# Altium project Hw_AIoT_Warehouse_Monitoring.PrjPcb
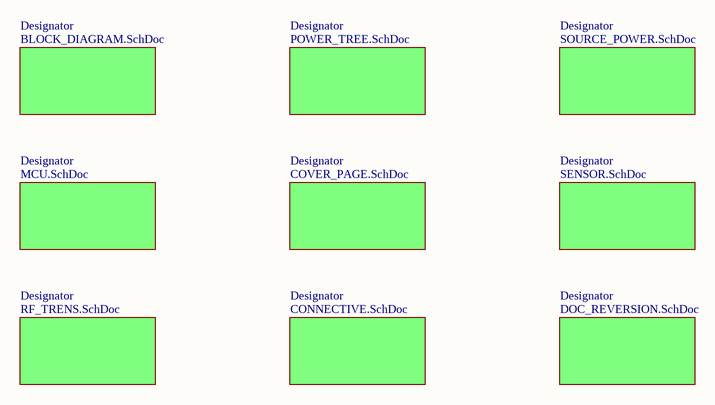
[diagram p0: LINK_PAGE.SchDoc]
10 sheets, 99 parts. Net scope: flat (ports and power ports of the same name join across sheets).
Sheets:
  LINK_PAGE.SchDoc
    Designator = BLOCK_DIAGRAM.SchDoc
    Designator = POWER_TREE.SchDoc
    Designator = SOURCE_POWER.SchDoc
    Designator = MCU.SchDoc
    Designator = COVER_PAGE.SchDoc
    Designator = SENSOR.SchDoc
    Designator = RF_TRENS.SchDoc
    Designator = CONNECTIVE.SchDoc
    Designator = DOC_REVERSION.SchDoc

## Sheet LINK_PAGE.SchDoc
size A; SheetNumber: 1; SheetTotal: 10

### Sub-sheets
Designator = BLOCK_DIAGRAM.SchDoc: no entries
Designator = POWER_TREE.SchDoc: no entries
Designator = SOURCE_POWER.SchDoc: no entries
Designator = MCU.SchDoc: no entries
Designator = COVER_PAGE.SchDoc: no entries
Designator = SENSOR.SchDoc: no entries
Designator = RF_TRENS.SchDoc: no entries
Designator = CONNECTIVE.SchDoc: no entries
Designator = DOC_REVERSION.SchDoc: no entries

## Sheet BLOCK_DIAGRAM.SchDoc
size A3; SheetNumber: 3; SheetTotal: 10
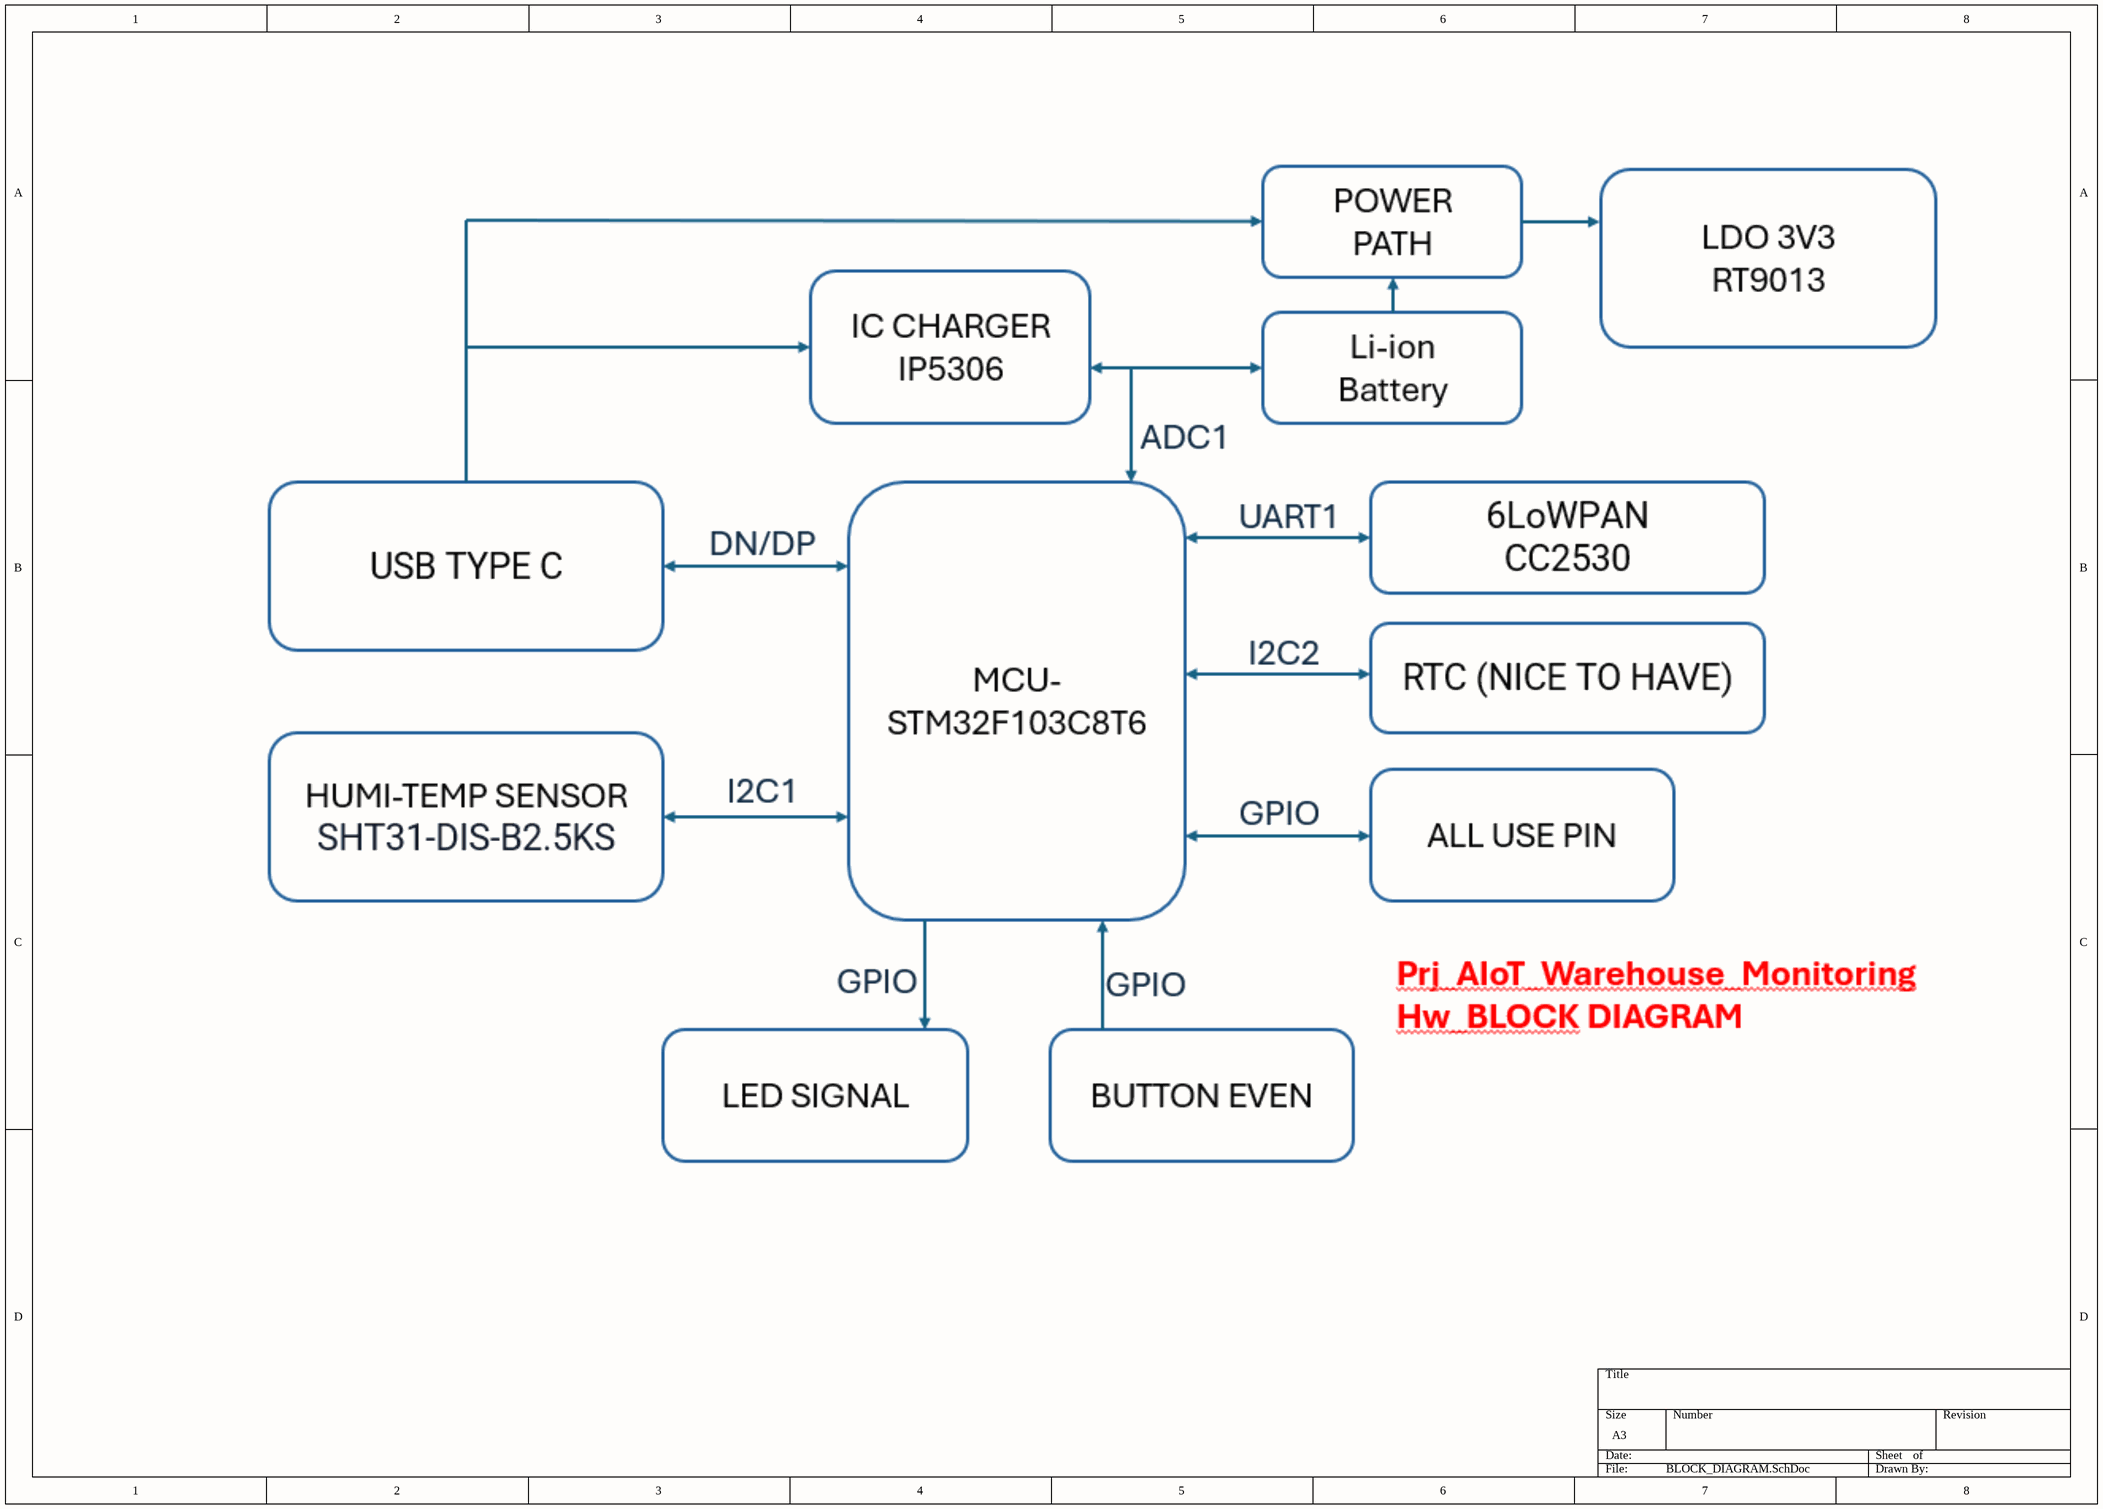
[diagram p1: BLOCK_DIAGRAM.SchDoc]

## Sheet POWER_TREE.SchDoc
size A; SheetNumber: 4; SheetTotal: 10

## Sheet SOURCE_POWER.SchDoc
size A3; SheetNumber: 5; SheetTotal: 10
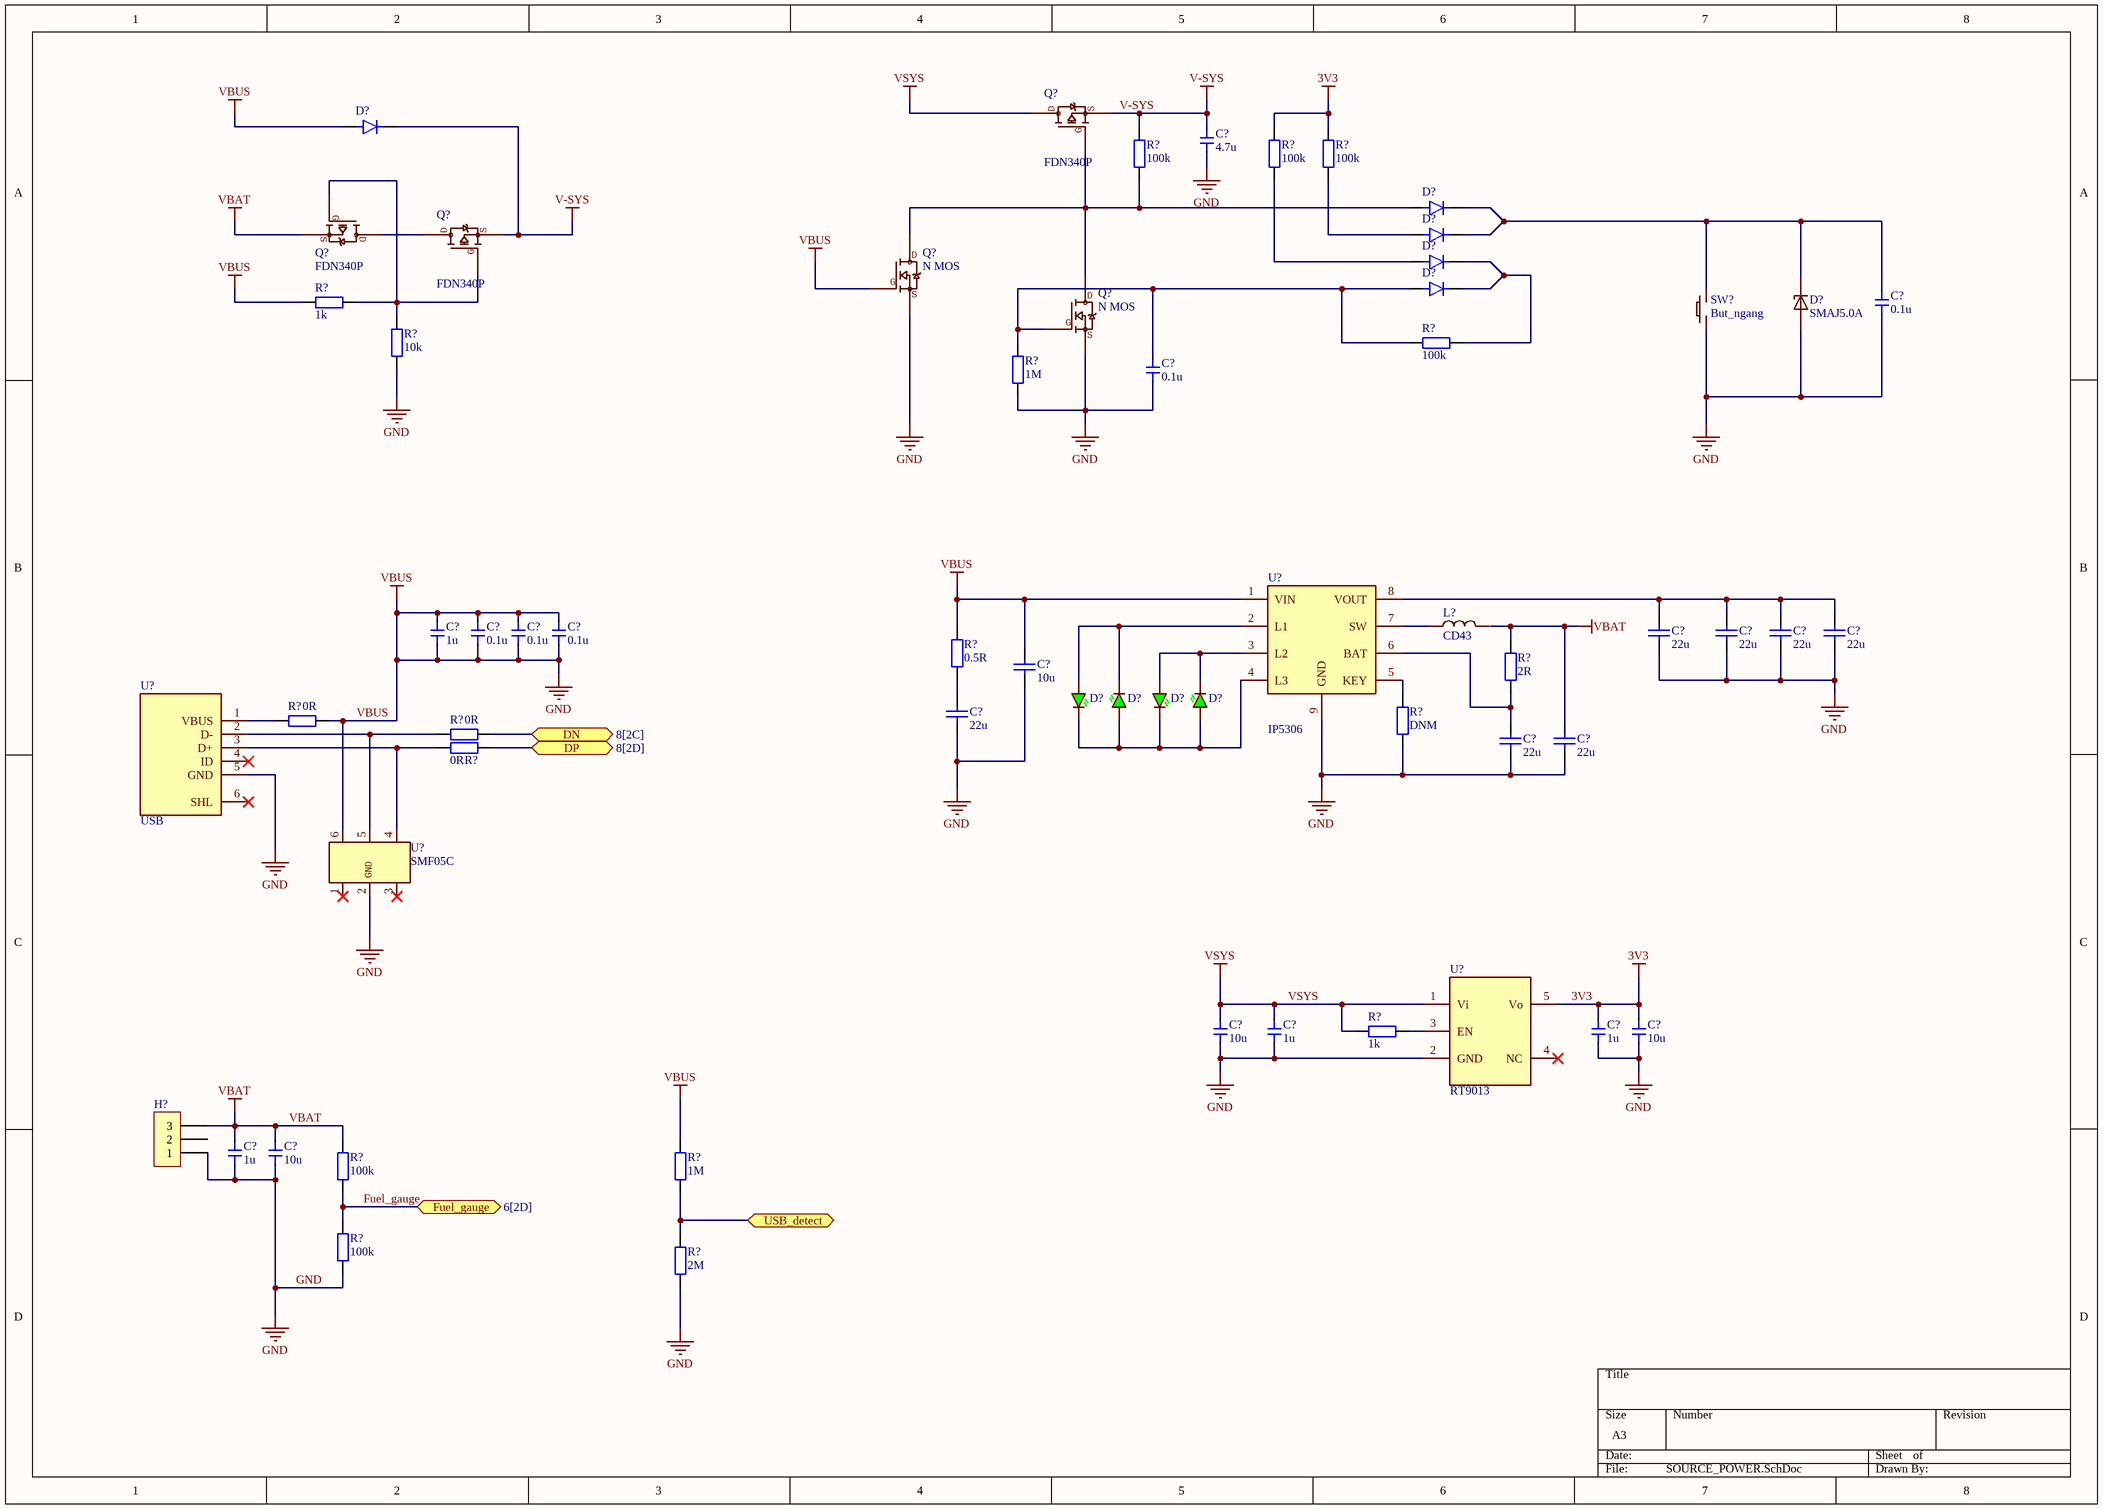
[diagram p2: SOURCE_POWER.SchDoc]

### Parts
(Parts that share a designator on the sheet are numbered #1, #2 ... from top to bottom, then left to right.)
C?#1  4.7u  [Cap 0603]
C?#2  0.1u  [Cap 0603]
C?#3  0.1u  [Cap 0603]
C?#4  22u  [tu 0805]
C?#5  22u  [tu 0805]
C?#6  22u  [tu 0805]
C?#7  22u  [tu 0805]
C?#8  1u  [Cap 0603]
C?#9  0.1u  [Cap 0603]
C?#10  0.1u  [Cap 0603]
C?#11  0.1u  [Cap 0603]
C?#12  10u  [tu 0805]
C?#13  22u  [tu 0805]
C?#14  22u  [tu 0805]
C?#15  22u  [tu 0805]
C?#16  10u  [Cap 0603]
C?#17  1u  [Cap 0603]
C?#18  1u  [Cap 0603]
C?#19  10u  [Cap 0603]
C?#20  1u  [Cap 0603]
C?#21  10u  [Cap 0603]
D?#1  LL4148  [DIO_LL4148]  (value not drawn)
D?#2  LL4148  [DIO_LL4148]  (value not drawn)
D?#3  LL4148  [DIO_LL4148]  (value not drawn)
D?#4  LL4148  [DIO_LL4148]  (value not drawn)
D?#5  LL4148  [DIO_LL4148]  (value not drawn)
D?#6  SMAJ5.0A  [DIOM4325X250N]
D?#7  Led 0603  [LED 0603]  (value not drawn)
D?#8  Led 0603  [LED 0603]  (value not drawn)
D?#9  Led 0603  [LED 0603]  (value not drawn)
D?#10  Led 0603  [LED 0603]  (value not drawn)
H?  Header 3P 2.54 Duc Thang  [XH2.54M-3]  (value not drawn)
L?  CD43  [CD43]
Q?#1  FDN340P  [FDN340P]
Q?#2  FDN340P  [FDN340P]
Q?#3  FDN340P  [FDN340P]
Q?#4  N MOS  [FDN340P]
Q?#5  N MOS  [FDN340P]
R?#1  100k  [Tro smd 0603]
R?#2  100k  [Tro smd 0603]
R?#3  100k  [Tro smd 0603]
R?#4  1k  [tro smd 0603]
R?#5  10k  [tro smd 0603]
R?#6  100k  [Tro smd 0603]
R?#7  1M  [Tro smd 0603]
R?#8  0.5R  [tro smd 0603]
R?#9  2R  [tro smd 0603]
R?#10  0R  [tro smd 0603]
R?#11  DNM  [tro smd 0603]
R?#12  0R  [tro smd 0603]
R?#13  0R  [tro smd 0603]
R?#14  1k  [tro smd 0603]
R?#15  100k  [Tro smd 0603]
R?#16  1M  [Tro smd 0603]
R?#17  100k  [Tro smd 0603]
R?#18  2M  [Tro smd 0603]
SW?#1  But_ngang  [But_ngang]
U?#1  IP5306  [IP5306]
U?#2  USB  [USB]
U?#3  SMF05C  [SOT-363]
U?#4  RT9013  [RT9013]

### Ports
DN (bidir, see 8[2C]), DP (bidir, see 8[2D]), Fuel_gauge (bidir, see 6[2D]), USB_detect (bidir)

### Nets
3V3: C?#18.1 C?#19.1 R?#2.2 R?#3.2 U?#4.5(Vo)
GND: C?#1.2 C?#2.2 C?#3.2 C?#4.2 C?#5.2 C?#6.2 C?#7.2 C?#8.1 C?#8.2 C?#9.1 C?#9.2 C?#10.1 C?#10.2 C?#11.1 C?#11.2 C?#12.1 C?#12.2 C?#13.2 C?#14.2 C?#15.2 C?#16.2 C?#17.2 C?#18.2 C?#19.2 C?#20.2 C?#21.2 D?#1.A D?#6.A H?.1 Q?#4.1(G) Q?#4.2(S) Q?#5.2(S) R?#4.1 R?#5.1 R?#7.1 R?#8.2 R?#10.2 R?#11.1 R?#16.2 R?#17.1 R?#18.1 SW?#1.1 U?#1.1(VIN) U?#1.9(GND) U?#2.5(GND) U?#3.2(GND) U?#3.6(IN4) U?#4.2(GND)  [also labelled VBUS]
V-SYS: C?#1.1 D?#1.C Q?#1.2(S) Q?#3.2(S) R?#1.2
VBAT: C?#15.1 C?#20.1 C?#21.1 H?.3 Q?#2.2(S) R?#9.2 R?#15.2
VSYS: C?#16.1 C?#17.1 Q?#1.3(D) R?#14.2 U?#4.1(Vi)
Fuel_gauge: R?#15.1 R?#17.2 ; port Fuel_gauge
NetC?#2_1: C?#2.1 D?#2.C D?#3.C D?#6.C SW?#1.2
NetC?#3_1: C?#3.1 D?#5.A Q?#5.1(G) R?#6.2 R?#7.2
NetC?#4_1: C?#4.1 C?#5.1 C?#6.1 C?#7.1 U?#1.8(VOUT)
NetC?#13_1: C?#13.1 R?#8.1
NetC?#14_1: C?#14.1 R?#9.1 U?#1.6(BAT)
NetD?#2_A: D?#2.A Q?#1.1(G) Q?#4.3(D) Q?#5.3(D) R?#1.1
NetD?#3_A: D?#3.A R?#3.1
NetD?#4_A: D?#4.A R?#2.1
NetD?#4_C: D?#4.C D?#5.C R?#6.1
NetD?#7_1: D?#7.1 D?#8.2 U?#1.2(L1)
NetD?#7_2: D?#7.2 D?#8.1 D?#9.2 D?#10.1 U?#1.4(L3)
NetD?#9_1: D?#9.1 D?#10.2 U?#1.3(L2)
NetJ?#2_2: R?#12.2 ; port DN
NetJ?#3_2: R?#13.2 ; port DP
NetL?_1: L?.1 U?#1.7(SW)
NetQ?#2_1: Q?#2.1(G) Q?#3.1(G) R?#4.2 R?#5.2
NetQ?#2_3: Q?#2.3(D) Q?#3.3(D)
NetR?#10_1: R?#10.1 U?#2.1(VBUS)
NetR?#11_2: R?#11.2 U?#1.5(KEY)
NetR?#12_1: R?#12.1 U?#2.2(D-) U?#3.5(IN4)
NetR?#13_1: R?#13.1 U?#2.3(D+) U?#3.4(IN3)
NetR?#14_1: R?#14.1 U?#4.3(EN)
NetR?#16_1: R?#16.1 R?#18.2 ; port USB_detect

Not connected (* = marked no-connect by the designer): H? 2; L? 2(10); U?#2 4(ID)* 6(SHL)*; U?#3 1(IN1)* 3(IN2)*; U?#4 4(NC)*

### Library data of the parts
C?#1-C?#3 C?#8-C?#11 C?#16-C?#21 = Cap 0603: Capacitor SMD 0603
C?#4-C?#7 C?#12-C?#15 = Tu 0805 20pF 50V 10%: Dán; Don_Vi: Con; Ten_Linh_Kien: Tụ 0805 20P 10% 50V; So_Chan: 2; Ma_Hang: MH004558; Chung_Loai: Dán; Kieu_Chan: *
D?#1-D?#5 = LL4148: Diode Standard 100 V 300mA Surface Mount SOD-80 MiniMELF; MF: onsemi; SnapEDA_Link: https://www.snapeda.com/parts/LL4148/Onsemi/view-part/?ref=snap; Package: SOD-80-2 ON Semiconductor; Value: *; MP: LL4148; Check_prices: https://www.snapeda.com/parts/LL4148/Onsemi/view-part/?ref=eda
D?#6 = SMAJ5.0A: 13.4V Clamp 174A (8/20Âµs) Ipp Tvs Diode Surface Mount SMA (DO-214AC); MP: SMAJ5.0A-TR; MF: STMicroelectronics; Purchase-URL: https://pricing.snapeda.com/search/part/SMAJ5.0A-TR/?ref=eda; Check_prices: https://www.snapeda.com/parts/SMAJ5.0A-TR/STMicroelectronics/view-part/?ref=eda; Availability: In Stock; Value: *; Price: None; Package: DO-214 STMicroelectronics; SnapEDA_Link: https://www.snapeda.com/parts/SMAJ5.0A-TR/STMicroelectronics/view-part/?ref=snap
H? = Header 3P 2.54 Duc Thang: Cắm; Ten_Linh_Kien: Header 3P XH2.54-3P Đực Thẳng; Don_Vi: Con; Ma_Hang: MH001292; Chung_Loai: Cắm
L? = CD43: https://www.thegioiic.com/cuon-cam-dan-smd-cd43-4532-1r0-1uh-2-7a
Q?#1-Q?#3 = FDN340P: Small Signal Field-Effect Transistor, 2A I(D), 20V, 1-Element, P-Channel, Silicon, Metal-oxide Semiconductor FET; Manufacturer: ON Semiconductor / Fairchild; Package Body Material: Plastic; Number of Elements: 1; Drain-source On Resistance-Max: 70R; Operating Mode: ENHANCEMENT MODE; Power Dissipation-Max (Abs): 500mW; Transistor Application: SWITCHING; Qualification Status: Not Qualified; Supplier 1: Digikey; Supplier Part Number 1: FDN340PCT-ND; Supplier: Digikey; Supplier Part Number: FDN340PCT-ND; Manufacturer Part Number: FDN340P; RoHS: Yes; Category: MOSFETs; Stock: 82276; Pricing: 1=0.46, 10=0.355, 100=0.213, 500=0.1972, 1000=0.1341, 3000=0.12345, 6000=0.11832, 9000=0.10649, 30000=0.10491, 75000=0.0986 (USD); Pins: 3; Package Shape: Rectangular; Transistor Element Material: SILICON; Terminal Finish: Tin; Max Operating Temperature: 150°C; JESD-30 Code: R-PDSO-G3; Moisture Sensitivity Level: 1; Package Style: SMALL OUTLINEMeter; Surface Mount: Yes; Terminal Form: Gull Wing; Terminal Position: DUAL; Polarity/Channel Type: P-CHANNEL; Drain Current-Max (Abs) (ID): 2A; Drain Current-Max (ID): 2A; DS Breakdown Voltage-Min: 20V; FET Technology: METAL-OXIDE SEMICONDUCTOR; JESD-609 Code: e3; Reach SVHC Compliant: Yes; RoHS Compliant: Yes; ComponentLink1URL: https://datasheet.ciiva.com:443/pdfs/VipMasterIC/IC/ONSM/ONSM-S-A0003584711/ONSM-S-A0003584686-1.pdf?src-supplier=IHS+Markit; ComponentLink1Description: https://datasheet.ciiva.com:443/pdfs/VipMasterIC/IC/ONSM/ONSM-S-A0003584711/ONSM-S-A0003584686-1.pdf?src-supplier=IHS+Markit
Q?#4 Q?#5 = LN2302LT1G: https://www.thegioiic.com/ln2302lt1g-mosfet-kenh-n-20v-2-3a-sot-23-3
R?#1-R?#3 R?#6 R?#7 R?#15-R?#18 = Tro 0603 1% 33k: Dán; Don_Vi: Con; So_Chan: 2; Ten_Linh_Kien: Trở 0603 1% 33k; Ma_Hang: MH006335; Chung_Loai: Dán; Kieu_Chan: *
R?#4 = Tro 0603 1% 1k: Dán; So_Chan: 2; Don_Vi: Con; Ten_Linh_Kien: Trở 0603 1% 1k; Ma_Hang: MH006334; Chung_Loai: Dán; Kieu_Chan: *
R?#5 = Tro 0603 1% 10k: Dán; Don_Vi: Con; So_Chan: 2; Ten_Linh_Kien: Trở 0603 1% 10k; Ma_Hang: MH006333; Chung_Loai: Dán; Kieu_Chan: *
R?#8 R?#9 R?#11 R?#14 = Tro 0603 1% 1R: Dán; Don_Vi: Con; So_Chan: 2; Ten_Linh_Kien: Trở 0603 1% 1R; Ma_Hang: MH007007; Chung_Loai: Dán; Kieu_Chan: *
R?#10 R?#12 R?#13 = Tro 0603 1% 0R: Dán; Don_Vi: Con; So_Chan: 2; Ten_Linh_Kien: Trở 0603 1% 0R; Ma_Hang: MH005792; Chung_Loai: Dán; Kieu_Chan: *
SW?#1 = But_ngang: https://www.thegioiic.com/nut-nhan-3x6mm-cao-3-5mm-4-chan-smd-chinh-ngang
U?#2 = usb: https://www.thegioiic.com/cong-usb-micro-b-2-0-dau-cai-5-chan-smd-v1
U?#3 = SMF05C: https://www.thegioiic.com/products?search=smf05

## Sheet MCU.SchDoc
size A4; SheetNumber: 6; SheetTotal: 10
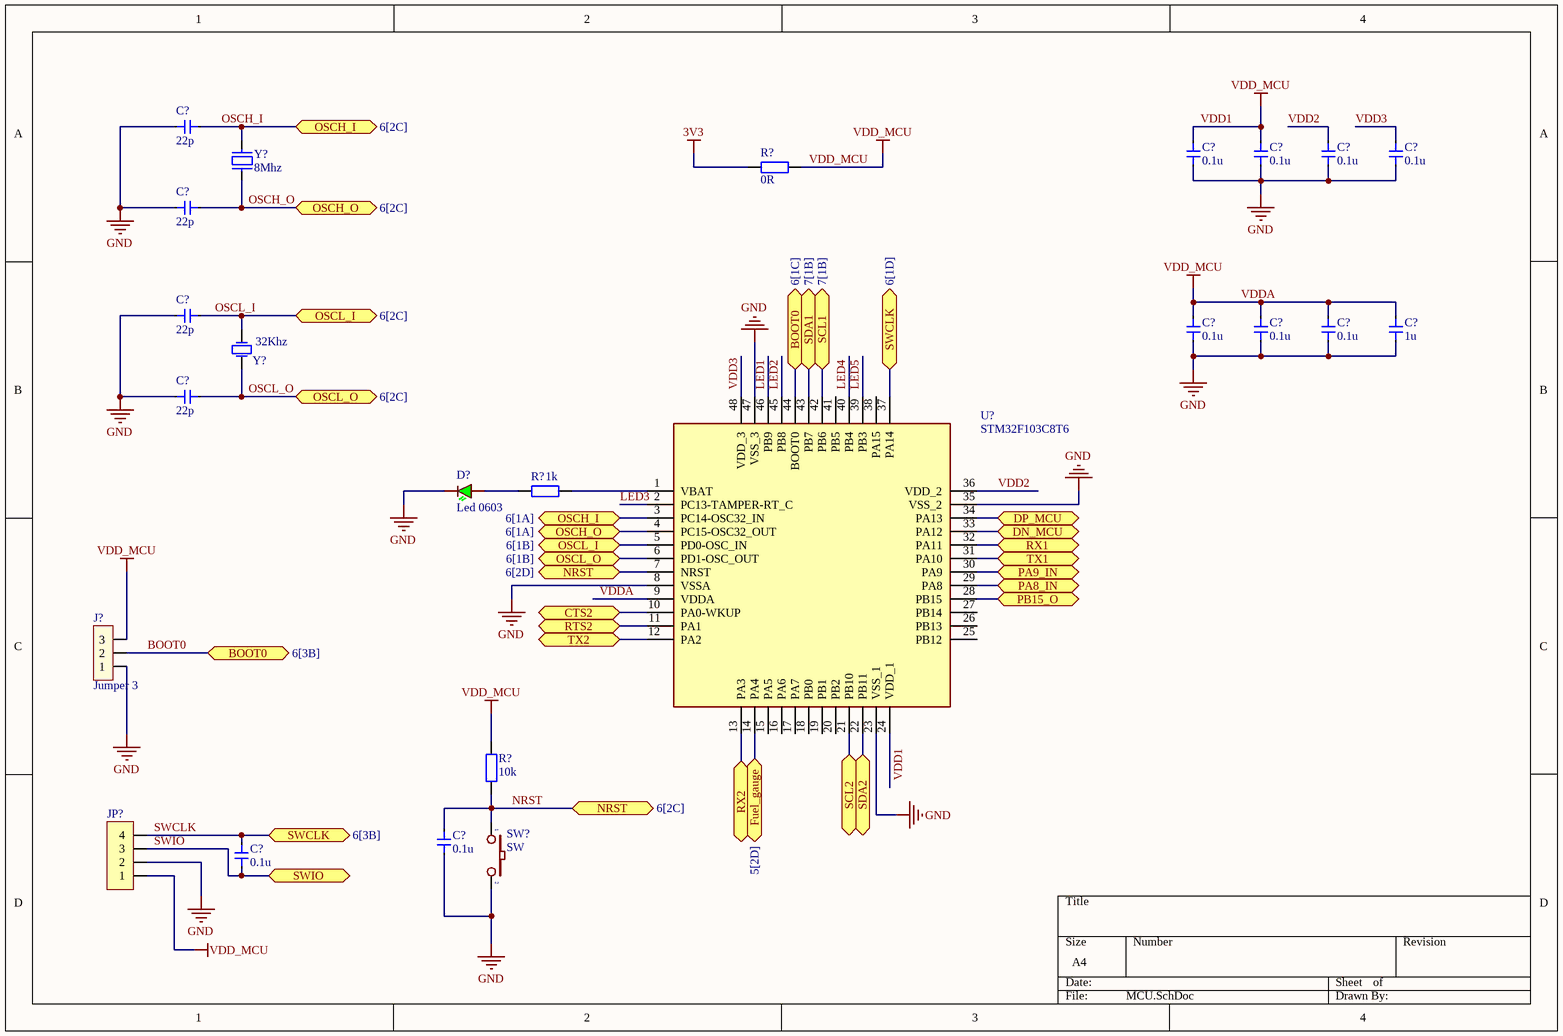
[diagram p3: MCU.SchDoc]

### Parts
(Parts that share a designator on the sheet are numbered #1, #2 ... from top to bottom, then left to right.)
C?#22  22p  [Cap 0603]
C?#23  0.1u  [Cap 0603]
C?#24  0.1u  [Cap 0603]
C?#25  0.1u  [Cap 0603]
C?#26  0.1u  [Cap 0603]
C?#27  22p  [Cap 0603]
C?#28  22p  [Cap 0603]
C?#29  0.1u  [Cap 0603]
C?#30  0.1u  [Cap 0603]
C?#31  0.1u  [Cap 0603]
C?#32  1u  [Cap 0603]
C?#33  22p  [Cap 0603]
C?#34  0.1u  [Cap 0603]
C?#35  0.1u  [Cap 0603]
D?#11  Led 0603  [LED 0603]
J?#1  Jumper 3  [JP3]
JP?  JP 1x4 2.54  [JP 1x4 DT]  (value not drawn)
R?#19  0R  [tro smd 0603]
R?#20  1k  [tro smd 0603]
R?#21  10k  [tro smd 0603]
SW?#2  SW  [SW2]
U?#5  STM32F103C8T6  [LQFP-48_19.6_393_58X11_SMD]
Y?#1  8Mhz  [Thach Anh 2 chan SMD5032]
Y?#2  32Khz  [THACH ANH DAN 3215]

### Ports
BOOT0 (bidir, see 6[1C]), BOOT0 (bidir, see 6[3B]), CTS2 (bidir), DN_MCU (bidir), DP_MCU (bidir), Fuel_gauge (bidir, see 5[2D]), NRST (bidir, see 6[2C]), NRST (bidir, see 6[2D]), OSCH_I (bidir, see 6[1A]), OSCH_I (bidir, see 6[2C]), OSCH_O (bidir, see 6[1A]), OSCH_O (bidir, see 6[2C]), OSCL_I (bidir, see 6[1B]), OSCL_I (bidir, see 6[2C]), OSCL_O (bidir, see 6[1B]), OSCL_O (bidir, see 6[2C]), PA8_IN (bidir), PA9_IN (bidir), PB15_O (bidir), RTS2 (bidir), RX1 (bidir), RX2 (bidir), SCL1 (bidir, see 7[1B]), SCL2 (bidir), SDA1 (bidir, see 7[1B]), SDA2 (bidir), SWCLK (bidir, see 6[1D]), SWCLK (bidir, see 6[3B]), SWIO (bidir), TX1 (bidir), TX2 (bidir)

### Nets
3V3: R?#19.1
GND: C?#22.1 C?#23.2 C?#24.2 C?#25.2 C?#26.2 C?#27.1 C?#28.1 C?#29.2 C?#30.2 C?#31.2 C?#32.2 C?#33.1 C?#34.2 D?#11.2 J?#1.1 JP?.2 SW?#2.2 U?#5.8(VSSA) U?#5.23(VSS_1) U?#5.35(VSS_2) U?#5.47(VSS_3)
VDD1: C?#23.1 C?#24.1 C?#29.1 C?#30.1 C?#31.1 C?#32.1 J?#1.3 JP?.1 R?#19.2 R?#21.2 U?#5.9(VDDA) U?#5.24(VDD_1)  [also labelled VDD_MCU, VDDA]
BOOT0: J?#1.2 U?#5.44(BOOT0) ; port BOOT0
Fuel_gauge: U?#5.14(PA4) ; port Fuel_gauge
LED1: U?#5.46(PB9)
LED2: U?#5.45(PB8)
LED3: U?#5.2(PC13-TAMPER-RT_C)
LED4: U?#5.40(PB4)
LED5: U?#5.39(PB3)
NRST: C?#34.1 R?#21.1 SW?#2.1 U?#5.7(NRST) ; port NRST
OSCH_I: C?#22.2 U?#5.3(PC14-OSC32_IN) Y?#1.2 ; port OSCH_I
OSCH_O: C?#27.2 U?#5.4(PC15-OSC32_OUT) Y?#1.1 ; port OSCH_O
OSCL_I: C?#28.2 U?#5.5(PD0-OSC_IN) Y?#2.2(OSC2) ; port OSCL_I
OSCL_O: C?#33.2 U?#5.6(PD1-OSC_OUT) Y?#2.1(OSC1) ; port OSCL_O
SWCLK: C?#35.1 JP?.4 U?#5.37(PA14) ; port SWCLK
SWIO: C?#35.2 JP?.3 ; port SWIO
VDD2: C?#25.1 U?#5.36(VDD_2)
VDD3: C?#26.1 U?#5.48(VDD_3)
NetD?#11_1: D?#11.1 R?#20.2
NetJ?#2_1: U?#5.34(PA13) ; port DP_MCU
NetJ?#3_1: U?#5.33(PA12) ; port DN_MCU
NetR?#20_1: R?#20.1 U?#5.1(VBAT)
NetR?#23_2: U?#5.42(PB6) ; port SCL1
NetR?#24_2: U?#5.43(PB7) ; port SDA1
NetU?#5_10: U?#5.10(PA0-WKUP) ; port CTS2
NetU?#5_11: U?#5.11(PA1) ; port RTS2
NetU?#5_12: U?#5.12(PA2) ; port TX2
NetU?#5_13: U?#5.13(PA3) ; port RX2
NetU?#5_21: U?#5.21(PB10) ; port SCL2
NetU?#5_22: U?#5.22(PB11) ; port SDA2
NetU?#5_28: U?#5.28(PB15) ; port PB15_O
NetU?#5_29: U?#5.29(PA8) ; port PA8_IN
NetU?#5_30: U?#5.30(PA9) ; port PA9_IN
NetU?#5_31: U?#5.31(PA10) ; port TX1
NetU?#5_32: U?#5.32(PA11) ; port RX1

Not connected (* = marked no-connect by the designer): U?#5 15(PA5) 16(PA6) 17(PA7) 18(PB0) 19(PB1) 20(PB2) 25(PB12) 26(PB13) 27(PB14) 38(PA15) 41(PB5)

### Library data of the parts
C?#22-C?#35 = Cap 0603: Capacitor SMD 0603
J?#1 = JP3: Value: J3
JP? = JP 1x4 2.54 Duc Thang: Cắm; Ten_Linh_Kien: Jump Đơn Đực 2.54MM 1x40P Thẳng 11MM; Don_Vi: Con; Ma_Hang: MH000903; Ghi_Chu: *; Kieu_Chan: *; Chung_Loai: Cắm
R?#19-R?#21 = Tro 0603 1% 10k: as R?#5 on sheet SOURCE_POWER; Chung_Loai: Dán; Kieu_Chan: *
SW?#2 = SW2: Switch button 2 pin; Value: SW chip 2 pin
U?#5 = IC_STM32F103C8T6: ARM® Cortex®-M3 STM32F1 Microcontroller IC 32-Bit 72MHz 64KB (64K x 8) FLASH 48-LQFP (7x7); Manufacturer: STMicroelectronics; Alternate Part Number-1: NA; Manufacturer Part Number: STM32F103C8T6; Case/Package: LQFP48; Supplier-1: LCSC; Supplier Part Number-1: STM32F103C8T6
Y?#1 = Thach Anh 2 chan SMD 5032: Crystal For all Crystal 2pin.; Value: 4Mhz
Y?#2 = Thach Anh SMD 3225: C700805; Chung_Loai: Dán; Ten_Linh_Kien: Thạch Anh 16Mhz SMD5032; Ma_Hang: MH001979; Don_Vi: Con; Ghi_Chu: *; Kieu_Chan: *

## Sheet COVER_PAGE.SchDoc
size A4; SheetNumber: 2; SheetTotal: 10
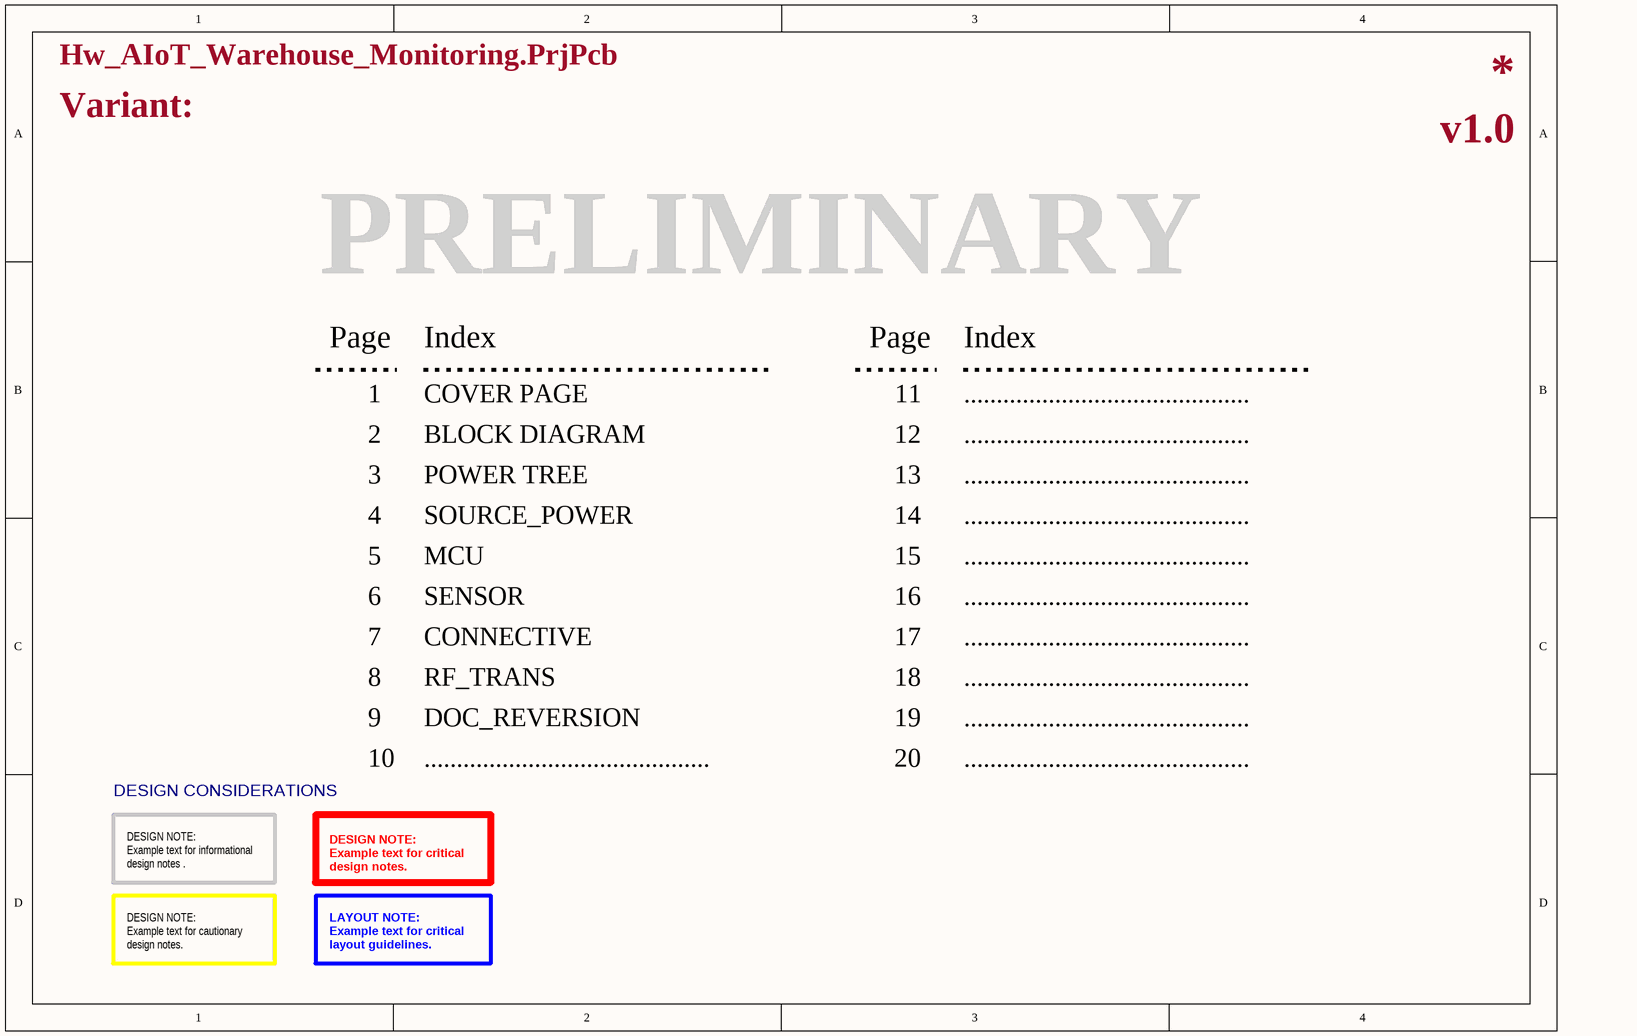
[diagram p4: COVER_PAGE.SchDoc]

### Notes on the sheet
- Variant:
- v1.0
- PRELIMINARY
- Page
- Index
- 1
- 2
- COVER PAGE
- BLOCK DIAGRAM
- 11
- 12
- ............................................
- 3
- POWER TREE
- 13
- 4
- 5
- SOURCE_POWER
- MCU
- 14
- 15
- 6
- 7
- SENSOR
- CONNECTIVE
- 16
- 17
- 8
- RF_TRANS
- 18
- 9
- 10
- DOC_REVERSION
- 19
- 20
- DESIGN CONSIDERATIONS
- DESIGN NOTE:
  Example text for informational
  design notes .
- DESIGN NOTE:
  Example text for critical
  design notes.
- DESIGN NOTE:
  Example text for cautionary
  design notes.
- LAYOUT NOTE:
  Example text for critical
  layout guidelines.

## Sheet SENSOR.SchDoc
size A; SheetNumber: 7; SheetTotal: 10
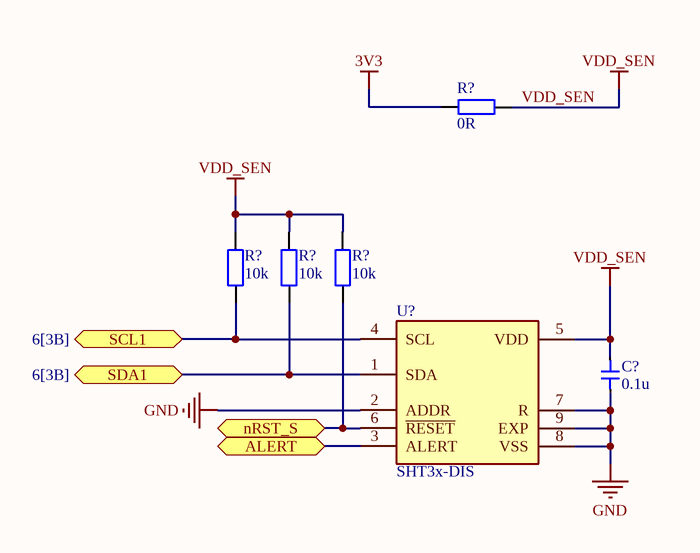
[diagram p5: SENSOR.SchDoc]

### Parts
(Parts that share a designator on the sheet are numbered #1, #2 ... from top to bottom, then left to right.)
C?#36  0.1u  [Cap 0603]
R?#22  0R  [tro smd 0603]
R?#23  10k  [tro smd 0603]
R?#24  10k  [tro smd 0603]
R?#25  10k  [tro smd 0603]
U?#6  SHT3x-DIS  [SHT3x]

### Ports
ALERT (bidir), nRST_S (bidir), SCL1 (bidir, see 6[3B]), SDA1 (bidir, see 6[3B])

### Nets
3V3: R?#22.1
GND: C?#36.2 U?#6.2(ADDR) U?#6.7(R) U?#6.8(VSS) U?#6.9(EXP)
VDD_SEN: C?#36.1 R?#22.2 R?#23.1 R?#24.1 R?#25.1 U?#6.5(VDD)
NetR?#23_2: R?#23.2 U?#6.4(SCL) ; port SCL1
NetR?#24_2: R?#24.2 U?#6.1(SDA) ; port SDA1
NetR?#25_2: R?#25.2 U?#6.6(~{RESET}) ; port nRST_S
NetU?#6_3: U?#6.3(ALERT) ; port ALERT

### Library data of the parts
C?#36 = Cap 0603: Capacitor SMD 0603
R?#22-R?#25 = Tro 0603 1% 10k: as R?#5 on sheet SOURCE_POWER; Chung_Loai: Dán; Kieu_Chan: *
U?#6 = SHT3x-DIS: Serial Switch/Digital Sensor, 16 Bit(s), Square, Surface Mount; Manufacturer: Sensirion; Manufacturer Part Number: SHT31-DIS-B2.5KS; Number of Bits: 16; Operating Current-Max: 1.5mA; Output Interface Type: I2C; Sensor Type: TEMPERATURE SENSOR,SWITCH/DIGITAL OUTPUT,SERIAL; Max Supply Voltage: 5.5V; Min Supply Voltage: 2.4V; Body Breadth: 2.5inch; Body Height: 0.9mm; Body Length or Diameter: 2.5mm; Supplier: Digikey; Supplier Part Number: 1649-1011-1-ND; RoHS: Yes; Category: Temperature and Humidity Sensors; Stock: 10892; Pricing: 1=5.32, 5=4.482, 10=4.164, 25=3.7784, 50=3.5112, 100=3.2631, 500=2.75274, 1000=2.55848 (USD); Mounting Technology: Surface Mount; Housing Material: Plastic; Package Shape/Style: Square; Terminal Finish: Gold; Min Operating Temperature: -40°C; Max Operating Temperature: 125°C; JESD-609 Code: e4; Termination: Solder; Reach SVHC Compliant: Yes; RoHS Compliant: Yes; ComponentLink1URL: https://datasheet.ciiva.com:443/pdfs/VipMasterIC/IC/SERI/SERI-S-A0007324878/SERI-S-A0007324878-1.pdf?src-supplier=IHS+Markit; ComponentLink1Description: https://datasheet.ciiva.com:443/pdfs/VipMasterIC/IC/SERI/SERI-S-A0007324878/SERI-S-A0007324878-1.pdf?src-supplier=IHS+Markit; ComponentLink2URL: https://media.digikey.com/pdf/Data%20Sheets/Sensirion%20PDFs/HT_DS_SHT3x_DIS.pdf?src-supplier=Digikey; ComponentLink2Description: https://media.digikey.com/pdf/Data%20Sheets/Sensirion%20PDFs/HT_DS_SHT3x_DIS.pdf?src-supplier=Digikey; ComponentLink3URL: https://datasheet.octopart.com/SHT31-DIS-B2.5KS-Sensirion-datasheet-166817248.pdf?src-supplier=Future+Electronics; ComponentLink3Description: https://datasheet.octopart.com/SHT31-DIS-B2.5KS-Sensirion-datasheet-166817248.pdf?src-supplier=Future+Electronics; ComponentLink4URL: https://datasheet.octopart.com/SHT31-DIS-B2.5KS-Sensirion-datasheet-157853116.pdf?src-supplier=SOS+electronic; ComponentLink4Description: https://datasheet.octopart.com/SHT31-DIS-B2.5KS-Sensirion-datasheet-157853116.pdf?src-supplier=SOS+electronic

## Sheet RF_TRENS.SchDoc
size A; SheetNumber: 9; SheetTotal: 9

## Sheet CONNECTIVE.SchDoc
size A; SheetNumber: 8; SheetTotal: 10
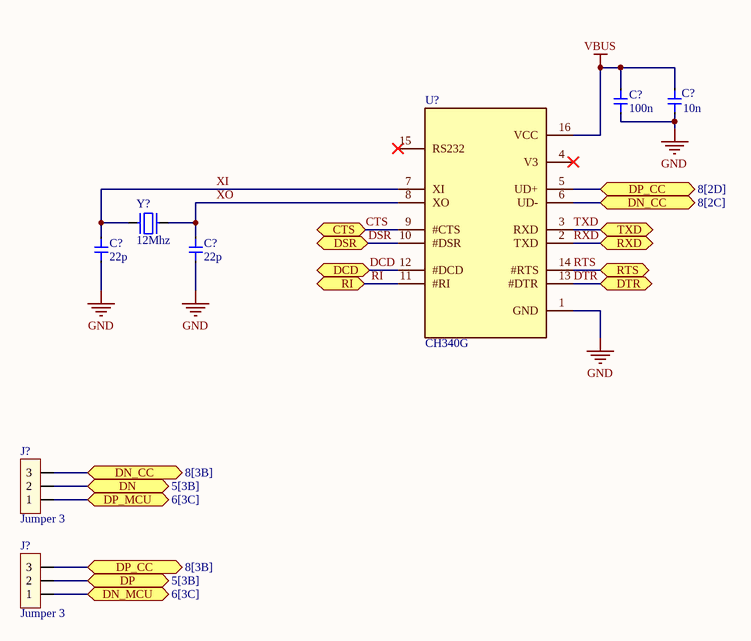
[diagram p6: CONNECTIVE.SchDoc]

### Parts
(Parts that share a designator on the sheet are numbered #1, #2 ... from top to bottom, then left to right.)
C?#37  100n  [Cap 0603]
C?#38  10n  [Cap 0603]
C?#39  22p  [Cap 0603]
C?#40  22p  [Cap 0603]
J?#2  Jumper 3  [JP3]
J?#3  Jumper 3  [JP3]
U?#7  CH340G  [CH340G]
Y?#3  12Mhz  [Thach Anh 2 chan SMD5032]

### Ports
CTS (bidir), DCD (bidir), DN (bidir, see 5[3B]), DN_CC (bidir, see 8[2C]), DN_CC (bidir, see 8[3B]), DN_MCU (bidir, see 6[3C]), DP (bidir, see 5[3B]), DP_CC (bidir, see 8[2D]), DP_CC (bidir, see 8[3B]), DP_MCU (bidir, see 6[3C]), DSR (bidir), DTR (bidir), RI (bidir), RTS (bidir), RXD (bidir), TXD (bidir)

### Nets
GND: C?#37.1 C?#37.2 C?#38.1 C?#38.2 C?#39.2 C?#40.2 U?#7.1(GND) U?#7.16(VCC)  [also labelled VBUS]
CTS: U?#7.9(#CTS) ; port CTS
DCD: U?#7.12(#DCD) ; port DCD
DSR: U?#7.10(#DSR) ; port DSR
DTR: U?#7.13(#DTR) ; port DTR
RI: U?#7.11(#RI) ; port RI
RTS: U?#7.14(#RTS) ; port RTS
RXD: U?#7.2(TXD) ; port RXD
TXD: U?#7.3(RXD) ; port TXD
XI: C?#39.1 U?#7.7(XI) Y?#3.1
XO: C?#40.1 U?#7.8(XO) Y?#3.2
NetJ?#2_1: J?#2.1 ; port DP_MCU
NetJ?#2_2: J?#2.2 ; port DN
NetJ?#2_3: J?#2.3 U?#7.6(UD-) ; port DN_CC
NetJ?#3_1: J?#3.1 ; port DN_MCU
NetJ?#3_2: J?#3.2 ; port DP
NetJ?#3_3: J?#3.3 U?#7.5(UD+) ; port DP_CC

Not connected (* = marked no-connect by the designer): U?#7 4(V3)* 15(RS232)*

### Library data of the parts
C?#37-C?#40 = Cap 0603: Capacitor SMD 0603
J?#2 J?#3 = JP3: Value: J3
Y?#3 = Thach Anh 2 chan SMD 5032: as Y?#1 on sheet MCU

## Sheet DOC_REVERSION.SchDoc
size A; SheetNumber: 10; SheetTotal: 10

## Nets that join several sheets
3V3: SOURCE_POWER (5 pins), MCU (R?#19.1), SENSOR (R?#22.1)
GND: SOURCE_POWER (48 pins), MCU (21 pins), SENSOR (5 pins), CONNECTIVE (8 pins)
Fuel_gauge: SOURCE_POWER (R?#15.1 R?#17.2), MCU (U?#5.14)
NetJ?#2_1: MCU (U?#5.34), CONNECTIVE (J?#2.1)
NetJ?#2_2: SOURCE_POWER (R?#12.2), CONNECTIVE (J?#2.2)
NetJ?#3_1: MCU (U?#5.33), CONNECTIVE (J?#3.1)
NetJ?#3_2: SOURCE_POWER (R?#13.2), CONNECTIVE (J?#3.2)
NetR?#23_2: MCU (U?#5.42), SENSOR (R?#23.2 U?#6.4)
NetR?#24_2: MCU (U?#5.43), SENSOR (R?#24.2 U?#6.1)

## Assembly variants
Variant of Hw_AIoT_Warehouse_Monitoring_Prototype: all parts fitted
Variant of Hw_AIoT_Warehouse_Monitoring: all parts fitted